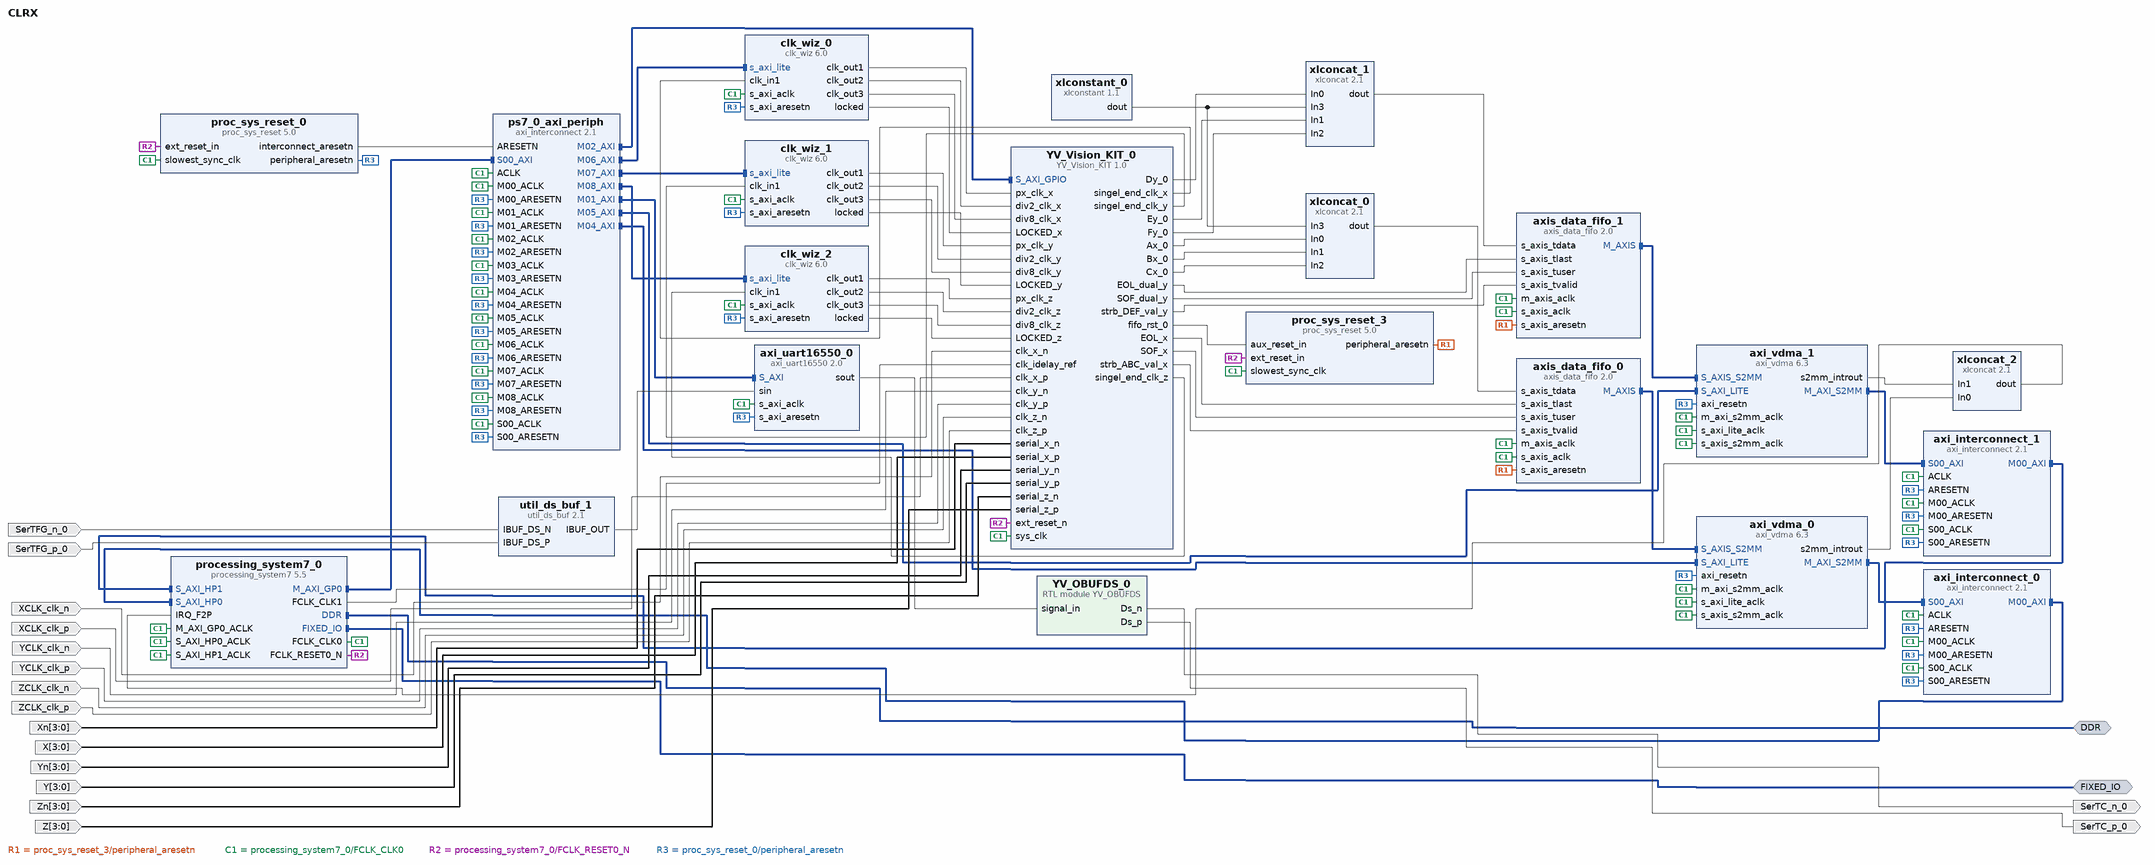
[diagram p0: block diagram of the top level]
# Vivado block design CLRX, xc7z020clg400-1, Vivado 2020.1
create_bd_design CLRX

create_bd_intf_port -mode Master -vlnv xilinx.com:interface:ddrx_rtl:1.0 DDR
create_bd_intf_port -mode Master -vlnv xilinx.com:display_processing_system7:fixedio_rtl:1.0 FIXED_IO
create_bd_port -dir O SerTC_n_0
create_bd_port -dir O -type data SerTC_p_0
create_bd_port -dir I -type data SerTFG_n_0
create_bd_port -dir I -type data SerTFG_p_0
create_bd_port -dir I -from 3 -to 0 X
create_bd_port -dir I XCLK_clk_n
create_bd_port -dir I XCLK_clk_p
create_bd_port -dir I -from 3 -to 0 Xn
create_bd_port -dir I -from 3 -to 0 Y
create_bd_port -dir I YCLK_clk_n
create_bd_port -dir I YCLK_clk_p
create_bd_port -dir I -from 3 -to 0 Yn
create_bd_port -dir I -from 3 -to 0 Z
create_bd_port -dir I ZCLK_clk_n
create_bd_port -dir I ZCLK_clk_p
create_bd_port -dir I -from 3 -to 0 Zn

create_bd_cell -type module -reference YV_OBUFDS YV_OBUFDS_0
create_bd_cell -type ip -vlnv YANTRAVISION:YV_CL:YV_Vision_KIT:1.0 YV_Vision_KIT_0
create_bd_cell -type ip -vlnv xilinx.com:ip:axi_interconnect:2.1 axi_interconnect_0
set_property -dict {CONFIG.NUM_MI 1} [get_bd_cells axi_interconnect_0]
create_bd_cell -type ip -vlnv xilinx.com:ip:axi_interconnect:2.1 axi_interconnect_1
set_property -dict {CONFIG.NUM_MI 1} [get_bd_cells axi_interconnect_1]
create_bd_cell -type ip -vlnv xilinx.com:ip:axi_uart16550:2.0 axi_uart16550_0
create_bd_cell -type ip -vlnv xilinx.com:ip:axi_vdma:6.3 axi_vdma_0
set_property -dict [list \
  CONFIG.c_include_mm2s 0 \
  CONFIG.c_include_s2mm 1 \
  CONFIG.c_m_axi_s2mm_data_width 32 \
  CONFIG.c_num_fstores 3 \
  CONFIG.c_s2mm_genlock_mode 2 \
  CONFIG.c_s2mm_linebuffer_depth 8192 \
  CONFIG.c_s2mm_max_burst_length 256 \
  CONFIG.c_use_s2mm_fsync 2 \
] [get_bd_cells axi_vdma_0]
create_bd_cell -type ip -vlnv xilinx.com:ip:axi_vdma:6.3 axi_vdma_1
set_property -dict [list \
  CONFIG.c_include_mm2s 0 \
  CONFIG.c_include_s2mm 1 \
  CONFIG.c_m_axi_s2mm_data_width 32 \
  CONFIG.c_num_fstores 3 \
  CONFIG.c_s2mm_genlock_mode 2 \
  CONFIG.c_s2mm_linebuffer_depth 8192 \
  CONFIG.c_s2mm_max_burst_length 256 \
  CONFIG.c_use_s2mm_fsync 2 \
] [get_bd_cells axi_vdma_1]
create_bd_cell -type ip -vlnv xilinx.com:ip:axis_data_fifo:2.0 axis_data_fifo_0
set_property -dict [list \
  CONFIG.FIFO_DEPTH 4096 \
  CONFIG.HAS_AEMPTY 1 \
  CONFIG.HAS_AFULL 1 \
  CONFIG.HAS_TLAST 1 \
  CONFIG.HAS_WR_DATA_COUNT 0 \
  CONFIG.IS_ACLK_ASYNC 1 \
  CONFIG.TDATA_NUM_BYTES 4 \
  CONFIG.TUSER_WIDTH 1 \
] [get_bd_cells axis_data_fifo_0]
create_bd_cell -type ip -vlnv xilinx.com:ip:axis_data_fifo:2.0 axis_data_fifo_1
set_property -dict [list \
  CONFIG.FIFO_DEPTH 4096 \
  CONFIG.HAS_AEMPTY 1 \
  CONFIG.HAS_AFULL 1 \
  CONFIG.HAS_TLAST 1 \
  CONFIG.IS_ACLK_ASYNC 1 \
  CONFIG.TDATA_NUM_BYTES 4 \
  CONFIG.TUSER_WIDTH 1 \
] [get_bd_cells axis_data_fifo_1]
create_bd_cell -type ip -vlnv xilinx.com:ip:clk_wiz:6.0 clk_wiz_0
set_property -dict [list \
  CONFIG.AXI_DRP true \
  CONFIG.CLKOUT2_JITTER 130.958 \
  CONFIG.CLKOUT2_PHASE_ERROR 98.575 \
  CONFIG.CLKOUT2_USED true \
  CONFIG.CLKOUT3_JITTER 130.958 \
  CONFIG.CLKOUT3_PHASE_ERROR 98.575 \
  CONFIG.CLKOUT3_USED true \
  CONFIG.MMCM_CLKOUT1_DIVIDE 10 \
  CONFIG.MMCM_CLKOUT2_DIVIDE 10 \
  CONFIG.MMCM_DIVCLK_DIVIDE 1 \
  CONFIG.NUM_OUT_CLKS 3 \
  CONFIG.USE_DYN_RECONFIG true \
] [get_bd_cells clk_wiz_0]
create_bd_cell -type ip -vlnv xilinx.com:ip:clk_wiz:6.0 clk_wiz_1
set_property -dict [list \
  CONFIG.AXI_DRP true \
  CONFIG.CLKOUT2_JITTER 130.958 \
  CONFIG.CLKOUT2_PHASE_ERROR 98.575 \
  CONFIG.CLKOUT2_USED true \
  CONFIG.CLKOUT3_JITTER 130.958 \
  CONFIG.CLKOUT3_PHASE_ERROR 98.575 \
  CONFIG.CLKOUT3_USED true \
  CONFIG.MMCM_CLKOUT1_DIVIDE 10 \
  CONFIG.MMCM_CLKOUT2_DIVIDE 10 \
  CONFIG.MMCM_DIVCLK_DIVIDE 1 \
  CONFIG.NUM_OUT_CLKS 3 \
  CONFIG.USE_DYN_RECONFIG true \
] [get_bd_cells clk_wiz_1]
create_bd_cell -type ip -vlnv xilinx.com:ip:clk_wiz:6.0 clk_wiz_2
set_property -dict [list \
  CONFIG.AXI_DRP true \
  CONFIG.CLKOUT2_JITTER 130.958 \
  CONFIG.CLKOUT2_PHASE_ERROR 98.575 \
  CONFIG.CLKOUT2_USED true \
  CONFIG.CLKOUT3_JITTER 130.958 \
  CONFIG.CLKOUT3_PHASE_ERROR 98.575 \
  CONFIG.CLKOUT3_USED true \
  CONFIG.MMCM_CLKOUT1_DIVIDE 10 \
  CONFIG.MMCM_CLKOUT2_DIVIDE 10 \
  CONFIG.MMCM_DIVCLK_DIVIDE 1 \
  CONFIG.NUM_OUT_CLKS 3 \
  CONFIG.USE_DYN_RECONFIG true \
] [get_bd_cells clk_wiz_2]
create_bd_cell -type ip -vlnv xilinx.com:ip:proc_sys_reset:5.0 proc_sys_reset_0
create_bd_cell -type ip -vlnv xilinx.com:ip:proc_sys_reset:5.0 proc_sys_reset_3
set_property -dict {CONFIG.C_AUX_RESET_HIGH 1} [get_bd_cells proc_sys_reset_3]
create_bd_cell -type ip -vlnv xilinx.com:ip:processing_system7:5.5 processing_system7_0
set_property -dict [list \
  CONFIG.PCW_APU_PERIPHERAL_FREQMHZ 667 \
  CONFIG.PCW_ENET0_ENET0_IO {MIO 16 .. 27} \
  CONFIG.PCW_ENET0_GRP_MDIO_ENABLE 1 \
  CONFIG.PCW_ENET0_GRP_MDIO_IO {MIO 52 .. 53} \
  CONFIG.PCW_ENET0_PERIPHERAL_ENABLE 1 \
  CONFIG.PCW_ENET0_RESET_ENABLE 0 \
  CONFIG.PCW_ENET_RESET_ENABLE 1 \
  CONFIG.PCW_ENET_RESET_SELECT {Share reset pin} \
  CONFIG.PCW_EN_CLK1_PORT 1 \
  CONFIG.PCW_FPGA0_PERIPHERAL_FREQMHZ 100 \
  CONFIG.PCW_FPGA1_PERIPHERAL_FREQMHZ 200 \
  CONFIG.PCW_FPGA2_PERIPHERAL_FREQMHZ 33.333333 \
  CONFIG.PCW_FPGA_FCLK1_ENABLE 1 \
  CONFIG.PCW_GP0_EN_MODIFIABLE_TXN 0 \
  CONFIG.PCW_GP1_EN_MODIFIABLE_TXN 0 \
  CONFIG.PCW_GPIO_EMIO_GPIO_ENABLE 1 \
  CONFIG.PCW_GPIO_EMIO_GPIO_IO 18 \
  CONFIG.PCW_GPIO_EMIO_GPIO_WIDTH 18 \
  CONFIG.PCW_GPIO_MIO_GPIO_ENABLE 1 \
  CONFIG.PCW_GPIO_MIO_GPIO_IO MIO \
  CONFIG.PCW_GPIO_PERIPHERAL_ENABLE 1 \
  CONFIG.PCW_I2C_RESET_ENABLE 0 \
  CONFIG.PCW_IRQ_F2P_INTR 1 \
  CONFIG.PCW_PERIPHERAL_BOARD_PRESET part0 \
  CONFIG.PCW_PRESET_BANK1_VOLTAGE {LVCMOS 1.8V} \
  CONFIG.PCW_QSPI_GRP_FBCLK_ENABLE 1 \
  CONFIG.PCW_QSPI_GRP_FBCLK_IO {MIO 8} \
  CONFIG.PCW_QSPI_GRP_SINGLE_SS_ENABLE 1 \
  CONFIG.PCW_QSPI_GRP_SINGLE_SS_IO {MIO 1 .. 6} \
  CONFIG.PCW_QSPI_PERIPHERAL_ENABLE 1 \
  CONFIG.PCW_QSPI_QSPI_IO {MIO 1 .. 6} \
  CONFIG.PCW_SD0_GRP_CD_ENABLE 1 \
  CONFIG.PCW_SD0_GRP_CD_IO {MIO 46} \
  CONFIG.PCW_SD0_GRP_WP_ENABLE 1 \
  CONFIG.PCW_SD0_GRP_WP_IO {MIO 50} \
  CONFIG.PCW_SD0_PERIPHERAL_ENABLE 1 \
  CONFIG.PCW_SD0_SD0_IO {MIO 40 .. 45} \
  CONFIG.PCW_SDIO_PERIPHERAL_FREQMHZ 50 \
  CONFIG.PCW_SINGLE_QSPI_DATA_MODE x4 \
  CONFIG.PCW_TTC0_CLK0_PERIPHERAL_CLKSRC External \
  CONFIG.PCW_TTC0_CLK1_PERIPHERAL_CLKSRC External \
  CONFIG.PCW_TTC0_CLK2_PERIPHERAL_CLKSRC External \
  CONFIG.PCW_UART1_PERIPHERAL_ENABLE 1 \
  CONFIG.PCW_UART1_UART1_IO {MIO 48 .. 49} \
  CONFIG.PCW_UART_PERIPHERAL_FREQMHZ 50 \
  CONFIG.PCW_UIPARAM_DDR_FREQ_MHZ 533.333333 \
  CONFIG.PCW_UIPARAM_DDR_MEMORY_TYPE {DDR 3 (Low Voltage)} \
  CONFIG.PCW_UIPARAM_DDR_PARTNO {MT41K256M16 RE-125} \
  CONFIG.PCW_USB0_PERIPHERAL_ENABLE 1 \
  CONFIG.PCW_USB0_RESET_ENABLE 1 \
  CONFIG.PCW_USB0_RESET_IO {MIO 7} \
  CONFIG.PCW_USB0_USB0_IO {MIO 28 .. 39} \
  CONFIG.PCW_USB_RESET_ENABLE 1 \
  CONFIG.PCW_USB_RESET_SELECT {Share reset pin} \
  CONFIG.PCW_USE_FABRIC_INTERRUPT 1 \
  CONFIG.PCW_USE_S_AXI_HP0 1 \
  CONFIG.PCW_USE_S_AXI_HP1 1 \
] [get_bd_cells processing_system7_0]
# 502 more settings of processing_system7_0 are not shown: defaults, MIO pin electricals, DDR timing, and values the tool derives
create_bd_cell -type ip -vlnv xilinx.com:ip:axi_interconnect:2.1 ps7_0_axi_periph
set_property -dict {CONFIG.NUM_MI 9 CONFIG.SYNCHRONIZATION_STAGES 2} [get_bd_cells ps7_0_axi_periph]
create_bd_cell -type ip -vlnv xilinx.com:ip:util_ds_buf:2.1 util_ds_buf_1
set_property -dict {CONFIG.C_BUF_TYPE IBUFDS} [get_bd_cells util_ds_buf_1]
create_bd_cell -type ip -vlnv xilinx.com:ip:xlconcat:2.1 xlconcat_0
set_property -dict [list \
  CONFIG.IN0_WIDTH 8 \
  CONFIG.IN1_WIDTH 8 \
  CONFIG.IN2_WIDTH 8 \
  CONFIG.IN3_WIDTH 8 \
  CONFIG.NUM_PORTS 4 \
] [get_bd_cells xlconcat_0]
create_bd_cell -type ip -vlnv xilinx.com:ip:xlconcat:2.1 xlconcat_1
set_property -dict [list \
  CONFIG.IN0_WIDTH 8 \
  CONFIG.IN1_WIDTH 8 \
  CONFIG.IN2_WIDTH 8 \
  CONFIG.IN3_WIDTH 8 \
  CONFIG.NUM_PORTS 4 \
] [get_bd_cells xlconcat_1]
create_bd_cell -type ip -vlnv xilinx.com:ip:xlconcat:2.1 xlconcat_2
create_bd_cell -type ip -vlnv xilinx.com:ip:xlconstant:1.1 xlconstant_0
set_property -dict {CONFIG.CONST_VAL 0 CONFIG.CONST_WIDTH 8} [get_bd_cells xlconstant_0]

# ---- connections ----

connect_bd_intf_net [get_bd_intf_ports DDR] [get_bd_intf_pins processing_system7_0/DDR]
connect_bd_intf_net [get_bd_intf_pins axi_vdma_1/S_AXIS_S2MM] [get_bd_intf_pins axis_data_fifo_1/M_AXIS]
connect_bd_intf_net [get_bd_intf_pins axi_interconnect_1/M00_AXI] [get_bd_intf_pins processing_system7_0/S_AXI_HP1]
connect_bd_intf_net [get_bd_intf_pins axi_interconnect_0/M00_AXI] [get_bd_intf_pins processing_system7_0/S_AXI_HP0]
connect_bd_intf_net [get_bd_intf_pins axi_vdma_0/S_AXIS_S2MM] [get_bd_intf_pins axis_data_fifo_0/M_AXIS]
connect_bd_intf_net [get_bd_intf_pins axi_interconnect_1/S00_AXI] [get_bd_intf_pins axi_vdma_1/M_AXI_S2MM]
connect_bd_intf_net [get_bd_intf_pins axi_interconnect_0/S00_AXI] [get_bd_intf_pins axi_vdma_0/M_AXI_S2MM]
connect_bd_intf_net [get_bd_intf_pins processing_system7_0/M_AXI_GP0] [get_bd_intf_pins ps7_0_axi_periph/S00_AXI]
connect_bd_intf_net [get_bd_intf_pins YV_Vision_KIT_0/S_AXI_GPIO] [get_bd_intf_pins ps7_0_axi_periph/M02_AXI]
connect_bd_intf_net [get_bd_intf_pins axi_vdma_1/S_AXI_LITE] [get_bd_intf_pins ps7_0_axi_periph/M05_AXI]
connect_bd_intf_net [get_bd_intf_pins clk_wiz_2/s_axi_lite] [get_bd_intf_pins ps7_0_axi_periph/M08_AXI]
connect_bd_intf_net [get_bd_intf_ports FIXED_IO] [get_bd_intf_pins processing_system7_0/FIXED_IO]
connect_bd_intf_net [get_bd_intf_pins clk_wiz_0/s_axi_lite] [get_bd_intf_pins ps7_0_axi_periph/M06_AXI]
connect_bd_intf_net [get_bd_intf_pins axi_uart16550_0/S_AXI] [get_bd_intf_pins ps7_0_axi_periph/M01_AXI]
connect_bd_intf_net [get_bd_intf_pins axi_vdma_0/S_AXI_LITE] [get_bd_intf_pins ps7_0_axi_periph/M04_AXI]
connect_bd_intf_net [get_bd_intf_pins clk_wiz_1/s_axi_lite] [get_bd_intf_pins ps7_0_axi_periph/M07_AXI]
connect_bd_net [get_bd_pins xlconstant_0/dout] [get_bd_pins xlconcat_0/In3] [get_bd_pins xlconcat_1/In3]
connect_bd_net [get_bd_pins proc_sys_reset_3/peripheral_aresetn] \
  [get_bd_pins axis_data_fifo_0/s_axis_aresetn] [get_bd_pins axis_data_fifo_1/s_axis_aresetn]
connect_bd_net [get_bd_ports SerTFG_n_0] [get_bd_pins util_ds_buf_1/IBUF_DS_N]
connect_bd_net [get_bd_ports SerTFG_p_0] [get_bd_pins util_ds_buf_1/IBUF_DS_P]
connect_bd_net [get_bd_pins YV_OBUFDS_0/Ds_n] [get_bd_ports SerTC_n_0]
connect_bd_net [get_bd_pins YV_OBUFDS_0/Ds_p] [get_bd_ports SerTC_p_0]
connect_bd_net [get_bd_pins YV_Vision_KIT_0/Ax_0] [get_bd_pins xlconcat_0/In0]
connect_bd_net [get_bd_pins YV_Vision_KIT_0/Bx_0] [get_bd_pins xlconcat_0/In1]
connect_bd_net [get_bd_pins YV_Vision_KIT_0/Cx_0] [get_bd_pins xlconcat_0/In2]
connect_bd_net [get_bd_pins YV_Vision_KIT_0/Dy_0] [get_bd_pins xlconcat_1/In0]
connect_bd_net [get_bd_pins YV_Vision_KIT_0/EOL_dual_y] [get_bd_pins axis_data_fifo_1/s_axis_tlast]
connect_bd_net [get_bd_pins YV_Vision_KIT_0/Ey_0] [get_bd_pins xlconcat_1/In1]
connect_bd_net [get_bd_pins YV_Vision_KIT_0/Fy_0] [get_bd_pins xlconcat_1/In2]
connect_bd_net [get_bd_pins YV_Vision_KIT_0/SOF_dual_y] [get_bd_pins axis_data_fifo_1/s_axis_tuser]
connect_bd_net [get_bd_pins YV_Vision_KIT_0/fifo_rst_0] [get_bd_pins proc_sys_reset_3/aux_reset_in]
connect_bd_net [get_bd_pins YV_Vision_KIT_0/singel_end_clk_x] [get_bd_pins clk_wiz_0/clk_in1]
connect_bd_net [get_bd_pins YV_Vision_KIT_0/singel_end_clk_y] [get_bd_pins clk_wiz_1/clk_in1]
connect_bd_net [get_bd_pins YV_Vision_KIT_0/singel_end_clk_z] [get_bd_pins clk_wiz_2/clk_in1]
connect_bd_net [get_bd_pins YV_Vision_KIT_0/strb_DEF_val_y] [get_bd_pins axis_data_fifo_1/s_axis_tvalid]
connect_bd_net [get_bd_pins axi_uart16550_0/sout] [get_bd_pins YV_OBUFDS_0/signal_in]
connect_bd_net [get_bd_pins axi_vdma_0/s2mm_introut] [get_bd_pins xlconcat_2/In0]
connect_bd_net [get_bd_pins axi_vdma_1/s2mm_introut] [get_bd_pins xlconcat_2/In1]
connect_bd_net [get_bd_pins clk_wiz_0/clk_out1] [get_bd_pins YV_Vision_KIT_0/px_clk_x]
connect_bd_net [get_bd_pins clk_wiz_0/clk_out2] [get_bd_pins YV_Vision_KIT_0/div2_clk_x]
connect_bd_net [get_bd_pins clk_wiz_0/clk_out3] [get_bd_pins YV_Vision_KIT_0/div8_clk_x]
connect_bd_net [get_bd_pins clk_wiz_0/locked] [get_bd_pins YV_Vision_KIT_0/LOCKED_x]
connect_bd_net [get_bd_pins clk_wiz_1/clk_out1] [get_bd_pins YV_Vision_KIT_0/px_clk_y]
connect_bd_net [get_bd_pins clk_wiz_1/clk_out2] [get_bd_pins YV_Vision_KIT_0/div2_clk_y]
connect_bd_net [get_bd_pins clk_wiz_1/clk_out3] [get_bd_pins YV_Vision_KIT_0/div8_clk_y]
connect_bd_net [get_bd_pins clk_wiz_1/locked] [get_bd_pins YV_Vision_KIT_0/LOCKED_y]
connect_bd_net [get_bd_pins clk_wiz_2/clk_out1] [get_bd_pins YV_Vision_KIT_0/px_clk_z]
connect_bd_net [get_bd_pins clk_wiz_2/clk_out2] [get_bd_pins YV_Vision_KIT_0/div2_clk_z]
connect_bd_net [get_bd_pins clk_wiz_2/clk_out3] [get_bd_pins YV_Vision_KIT_0/div8_clk_z]
connect_bd_net [get_bd_pins clk_wiz_2/locked] [get_bd_pins YV_Vision_KIT_0/LOCKED_z]
connect_bd_net -net clk_x_n_0_1 [get_bd_ports XCLK_clk_n] [get_bd_pins YV_Vision_KIT_0/clk_x_n]
connect_bd_net -net clk_x_p_0_1 [get_bd_ports XCLK_clk_p] [get_bd_pins YV_Vision_KIT_0/clk_x_p]
connect_bd_net -net clk_y_n_0_1 [get_bd_ports YCLK_clk_n] [get_bd_pins YV_Vision_KIT_0/clk_y_n]
connect_bd_net -net clk_y_p_0_1 [get_bd_ports YCLK_clk_p] [get_bd_pins YV_Vision_KIT_0/clk_y_p]
connect_bd_net -net clk_z_n_0_1 [get_bd_ports ZCLK_clk_n] [get_bd_pins YV_Vision_KIT_0/clk_z_n]
connect_bd_net -net clk_z_p_0_1 [get_bd_ports ZCLK_clk_p] [get_bd_pins YV_Vision_KIT_0/clk_z_p]
connect_bd_net [get_bd_pins processing_system7_0/FCLK_CLK0] \
  [get_bd_pins YV_Vision_KIT_0/sys_clk] [get_bd_pins axi_interconnect_0/ACLK] [get_bd_pins axi_interconnect_0/M00_ACLK] \
  [get_bd_pins axi_interconnect_0/S00_ACLK] [get_bd_pins axi_interconnect_1/ACLK] [get_bd_pins axi_interconnect_1/M00_ACLK] \
  [get_bd_pins axi_interconnect_1/S00_ACLK] [get_bd_pins axi_uart16550_0/s_axi_aclk] [get_bd_pins axi_vdma_0/m_axi_s2mm_aclk] \
  [get_bd_pins axi_vdma_0/s_axi_lite_aclk] [get_bd_pins axi_vdma_0/s_axis_s2mm_aclk] [get_bd_pins axi_vdma_1/m_axi_s2mm_aclk] \
  [get_bd_pins axi_vdma_1/s_axi_lite_aclk] [get_bd_pins axi_vdma_1/s_axis_s2mm_aclk] \
  [get_bd_pins axis_data_fifo_0/m_axis_aclk] [get_bd_pins axis_data_fifo_0/s_axis_aclk] \
  [get_bd_pins axis_data_fifo_1/m_axis_aclk] [get_bd_pins axis_data_fifo_1/s_axis_aclk] [get_bd_pins clk_wiz_0/s_axi_aclk] \
  [get_bd_pins clk_wiz_1/s_axi_aclk] [get_bd_pins clk_wiz_2/s_axi_aclk] [get_bd_pins proc_sys_reset_0/slowest_sync_clk] \
  [get_bd_pins proc_sys_reset_3/slowest_sync_clk] [get_bd_pins processing_system7_0/M_AXI_GP0_ACLK] \
  [get_bd_pins processing_system7_0/S_AXI_HP0_ACLK] [get_bd_pins processing_system7_0/S_AXI_HP1_ACLK] \
  [get_bd_pins ps7_0_axi_periph/ACLK] [get_bd_pins ps7_0_axi_periph/M00_ACLK] [get_bd_pins ps7_0_axi_periph/M01_ACLK] \
  [get_bd_pins ps7_0_axi_periph/M02_ACLK] [get_bd_pins ps7_0_axi_periph/M03_ACLK] [get_bd_pins ps7_0_axi_periph/M04_ACLK] \
  [get_bd_pins ps7_0_axi_periph/M05_ACLK] [get_bd_pins ps7_0_axi_periph/M06_ACLK] [get_bd_pins ps7_0_axi_periph/M07_ACLK] \
  [get_bd_pins ps7_0_axi_periph/M08_ACLK] [get_bd_pins ps7_0_axi_periph/S00_ACLK]
connect_bd_net [get_bd_pins processing_system7_0/FCLK_CLK1] [get_bd_pins YV_Vision_KIT_0/clk_idelay_ref]
connect_bd_net [get_bd_pins processing_system7_0/FCLK_RESET0_N] \
  [get_bd_pins YV_Vision_KIT_0/ext_reset_n] [get_bd_pins proc_sys_reset_0/ext_reset_in] \
  [get_bd_pins proc_sys_reset_3/ext_reset_in]
connect_bd_net -net rst_ps7_0_100M_interconnect_aresetn [get_bd_pins proc_sys_reset_0/interconnect_aresetn] [get_bd_pins ps7_0_axi_periph/ARESETN]
connect_bd_net -net rst_ps7_0_100M_peripheral_aresetn [get_bd_pins proc_sys_reset_0/peripheral_aresetn] \
  [get_bd_pins axi_interconnect_0/ARESETN] [get_bd_pins axi_interconnect_0/M00_ARESETN] \
  [get_bd_pins axi_interconnect_0/S00_ARESETN] [get_bd_pins axi_interconnect_1/ARESETN] \
  [get_bd_pins axi_interconnect_1/M00_ARESETN] [get_bd_pins axi_interconnect_1/S00_ARESETN] \
  [get_bd_pins axi_uart16550_0/s_axi_aresetn] [get_bd_pins axi_vdma_0/axi_resetn] [get_bd_pins axi_vdma_1/axi_resetn] \
  [get_bd_pins clk_wiz_0/s_axi_aresetn] [get_bd_pins clk_wiz_1/s_axi_aresetn] [get_bd_pins clk_wiz_2/s_axi_aresetn] \
  [get_bd_pins ps7_0_axi_periph/M00_ARESETN] [get_bd_pins ps7_0_axi_periph/M01_ARESETN] \
  [get_bd_pins ps7_0_axi_periph/M02_ARESETN] [get_bd_pins ps7_0_axi_periph/M03_ARESETN] \
  [get_bd_pins ps7_0_axi_periph/M04_ARESETN] [get_bd_pins ps7_0_axi_periph/M05_ARESETN] \
  [get_bd_pins ps7_0_axi_periph/M06_ARESETN] [get_bd_pins ps7_0_axi_periph/M07_ARESETN] \
  [get_bd_pins ps7_0_axi_periph/M08_ARESETN] [get_bd_pins ps7_0_axi_periph/S00_ARESETN]
connect_bd_net -net rx_adaptor_0_eol [get_bd_pins YV_Vision_KIT_0/EOL_x] [get_bd_pins axis_data_fifo_0/s_axis_tlast]
connect_bd_net -net rx_adaptor_0_sof [get_bd_pins YV_Vision_KIT_0/SOF_x] [get_bd_pins axis_data_fifo_0/s_axis_tuser]
connect_bd_net -net rx_adaptor_0_strb_ABC_val [get_bd_pins YV_Vision_KIT_0/strb_ABC_val_x] [get_bd_pins axis_data_fifo_0/s_axis_tvalid]
connect_bd_net -net serial_x_n_0_1 [get_bd_ports Xn] [get_bd_pins YV_Vision_KIT_0/serial_x_n]
connect_bd_net -net serial_x_p_0_1 [get_bd_ports X] [get_bd_pins YV_Vision_KIT_0/serial_x_p]
connect_bd_net -net serial_y_n_0_1 [get_bd_ports Yn] [get_bd_pins YV_Vision_KIT_0/serial_y_n]
connect_bd_net -net serial_y_p_0_1 [get_bd_ports Y] [get_bd_pins YV_Vision_KIT_0/serial_y_p]
connect_bd_net -net serial_z_n_0_1 [get_bd_ports Zn] [get_bd_pins YV_Vision_KIT_0/serial_z_n]
connect_bd_net -net serial_z_p_0_1 [get_bd_ports Z] [get_bd_pins YV_Vision_KIT_0/serial_z_p]
connect_bd_net [get_bd_pins util_ds_buf_1/IBUF_OUT] [get_bd_pins axi_uart16550_0/sin]
connect_bd_net [get_bd_pins xlconcat_0/dout] [get_bd_pins axis_data_fifo_0/s_axis_tdata]
connect_bd_net [get_bd_pins xlconcat_1/dout] [get_bd_pins axis_data_fifo_1/s_axis_tdata]
connect_bd_net [get_bd_pins xlconcat_2/dout] [get_bd_pins processing_system7_0/IRQ_F2P]

# ---- address map ----
assign_bd_address -offset 0x00000000 -range 1G -target_address_space [get_bd_addr_spaces axi_vdma_0/Data_S2MM] [get_bd_addr_segs processing_system7_0/S_AXI_HP0/HP0_DDR_LOWOCM]
assign_bd_address -offset 0x00000000 -range 1G -target_address_space [get_bd_addr_spaces axi_vdma_1/Data_S2MM] [get_bd_addr_segs processing_system7_0/S_AXI_HP1/HP1_DDR_LOWOCM]
assign_bd_address -offset 0x43000000 -range 64K -target_address_space [get_bd_addr_spaces processing_system7_0/Data] [get_bd_addr_segs axi_vdma_0/S_AXI_LITE/Reg]
assign_bd_address -offset 0x43010000 -range 64K -target_address_space [get_bd_addr_spaces processing_system7_0/Data] [get_bd_addr_segs axi_vdma_1/S_AXI_LITE/Reg]
assign_bd_address -offset 0x43C00000 -range 64K -target_address_space [get_bd_addr_spaces processing_system7_0/Data] [get_bd_addr_segs axi_uart16550_0/S_AXI/Reg]
assign_bd_address -offset 0x43C10000 -range 64K -target_address_space [get_bd_addr_spaces processing_system7_0/Data] [get_bd_addr_segs YV_Vision_KIT_0/S_AXI_GPIO/Reg]
assign_bd_address -offset 0x43C20000 -range 64K -target_address_space [get_bd_addr_spaces processing_system7_0/Data] [get_bd_addr_segs clk_wiz_0/s_axi_lite/Reg]
assign_bd_address -offset 0x43C30000 -range 64K -target_address_space [get_bd_addr_spaces processing_system7_0/Data] [get_bd_addr_segs clk_wiz_1/s_axi_lite/Reg]
assign_bd_address -offset 0x43C40000 -range 64K -target_address_space [get_bd_addr_spaces processing_system7_0/Data] [get_bd_addr_segs clk_wiz_2/s_axi_lite/Reg]

validate_bd_design
save_bd_design
